# EAGLE schematic Control v1 (EAGLE 7.2.0)
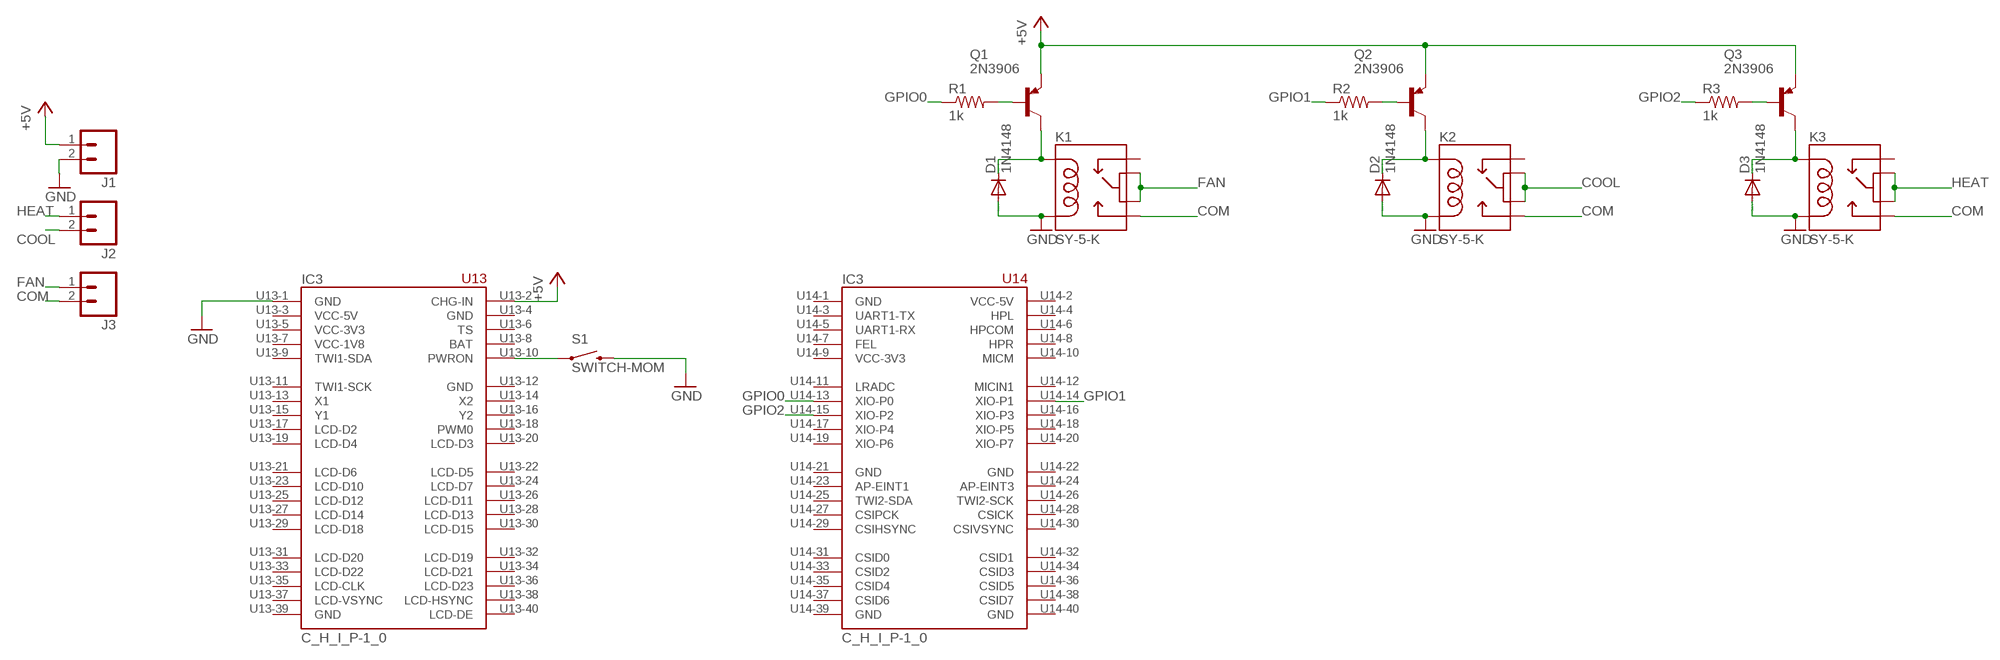
[diagram p0: schematic, sheet 1]

## Parts
D1  1N4148  1N4148DO35-7  [DO35-7]
D2  1N4148  1N4148DO35-7  [DO35-7]
D3  1N4148  1N4148DO35-7  [DO35-7]
IC3  C_H_I_P-1_0  [C_H_I_P-1_0]
J1  M023.5MM  [SCREWTERMINAL-3.5MM-2]
J2  M023.5MM  [SCREWTERMINAL-3.5MM-2]
J3  M023.5MM  [SCREWTERMINAL-3.5MM-2]
K1  SY-5-K  RELAY-2G5Q  [RELAY-G5V]
K2  SY-5-K  RELAY-2G5Q  [RELAY-G5V]
K3  SY-5-K  RELAY-2G5Q  [RELAY-G5V]
Q1  2N3906  [TO92]
Q2  2N3906  [TO92]
Q3  2N3906  [TO92]
R1  1k  R-US_0207/10  [0207/10]
R2  1k  R-US_0207/10  [0207/10]
R3  1k  R-US_0207/10  [0207/10]
S1  SWITCH-MOM  SWITCH-MOMENTARY-2PTH  [TACTILE-PTH]

## Nets
+5V: IC3.U13-2(CHG-IN) J1.1 Q1.3(E) Q2.3(E) Q3.3(E)
COM: J3.2 K1.10
COOL: J2.2 K2.5 K2.6
FAN: J3.1 K1.5 K1.6
GND: D1.A D2.A D3.A IC3.U13-1(GND) J1.2 K1.9 K2.9 K3.9 S1.3
GPIO0: IC3.U14-13(XIO-P0) R1.1
GPIO1: IC3.U14-14(XIO-P1) R2.1
GPIO2: IC3.U14-15(XIO-P2) R3.1
HEAT: J2.1 K3.5 K3.6
N$1: IC3.U13-10(PWRON) S1.1
N$3: Q2.2(B) R2.2
N$4: Q1.2(B) R1.2
N$5: D1.C K1.2 Q1.1(C)
N$7: D2.C K2.2 Q2.1(C)
N$8: Q3.2(B) R3.2
N$9: D3.C K3.2 Q3.1(C)
Unconnected: IC3.U13-3(VCC-5V) IC3.U13-5(VCC-3V3) IC3.U13-6(TS) IC3.U13-7(VCC-1V8) IC3.U13-9(TWI1-SDA) IC3.U13-11(TWI1-SCK) IC3.U13-13(X1) IC3.U13-14(X2) IC3.U13-15(Y1) IC3.U13-16(Y2) IC3.U13-17(LCD-D2) IC3.U13-18(PWM0) IC3.U13-19(LCD-D4) IC3.U13-20(LCD-D3) IC3.U13-21(LCD-D6) IC3.U13-22(LCD-D5) IC3.U13-23(LCD-D10) IC3.U13-24(LCD-D7) IC3.U13-25(LCD-D12) IC3.U13-26(LCD-D11) IC3.U13-27(LCD-D14) IC3.U13-28(LCD-D13) IC3.U13-29(LCD-D18) IC3.U13-30(LCD-D15) IC3.U13-31(LCD-D20) IC3.U13-32(LCD-D19) IC3.U13-33(LCD-D22) IC3.U13-34(LCD-D21) IC3.U13-35(LCD-CLK) IC3.U13-36(LCD-D23) IC3.U13-37(LCD-VSYNC) IC3.U13-38(LCD-HSYNC) IC3.U13-40(LCD-DE) IC3.U14-2(VCC-5V) IC3.U14-3(UART1-TX) IC3.U14-4(HPL) IC3.U14-5(UART1-RX) IC3.U14-6(HPCOM) IC3.U14-7(FEL) IC3.U14-8(HPR) IC3.U14-9(VCC-3V3) IC3.U14-10(MICM) IC3.U14-11(LRADC) IC3.U14-12(MICIN1) IC3.U14-16(XIO-P3) IC3.U14-17(XIO-P4) IC3.U14-18(XIO-P5) IC3.U14-19(XIO-P6) IC3.U14-20(XIO-P7) IC3.U14-23(AP-EINT1) IC3.U14-24(AP-EINT3) IC3.U14-25(TWI2-SDA) IC3.U14-26(TWI2-SCK) IC3.U14-27(CSIPCK) IC3.U14-28(CSICK) IC3.U14-29(CSIHSYNC) IC3.U14-30(CSIVSYNC) IC3.U14-31(CSID0) IC3.U14-32(CSID1) IC3.U14-33(CSID2) IC3.U14-34(CSID3) IC3.U14-35(CSID4) IC3.U14-36(CSID5) IC3.U14-37(CSID6) IC3.U14-38(CSID7) K1.1 K2.1 K2.10 K3.1 K3.10

## Power pins joined to a net without a drawn wire
BAT: IC3.U13-8(BAT)
GND: IC3.U13-4(GND) IC3.U13-12(GND) IC3.U13-39(GND) IC3.U14-1(GND) IC3.U14-21(GND) IC3.U14-22(GND) IC3.U14-39(GND) IC3.U14-40(GND)

## Library data of the parts
D1-D3 = diode:1N4148: DIODE high speed (Philips)
IC3 = SENG:C_H_I_P-1_0: C.H.I.P. 1.0 Linux computer module with on chip power management unit
J1-J3 = SparkFun-Connectors:M02: Standard 2-pin 0.1" header. Use with - straight break away headers ( PRT-00116) - right angle break away headers (PRT-00553) - swiss pins (PRT-00743) - machine pins (PRT-00117) - female headers (PRT-00115) Molex polarized connector foot print use with: PRT-08233 with associated crimp pins and housings. 2.54_SCREWTERM for use with PRT-10571. 3.5mm Screw Terminal footprints for PRT-08084 5mm Screw Terminal footprints for use with PRT-08432; PROD_ID: CONN-08399
K1-K3 = SparkFun-Electromechanical:RELAY-2: SPDT relay (COM-00100)
Q1-Q3 = transistor-pnp:2N3906: PNP Transistor
R1-R3 = rcl:R-US_: RESISTOR, American symbol
S1 = SparkFun-Electromechanical:SWITCH-MOMENTARY-2: Various NO switches- pushbuttons, reed, etc; PROD_ID: SWCH-08441